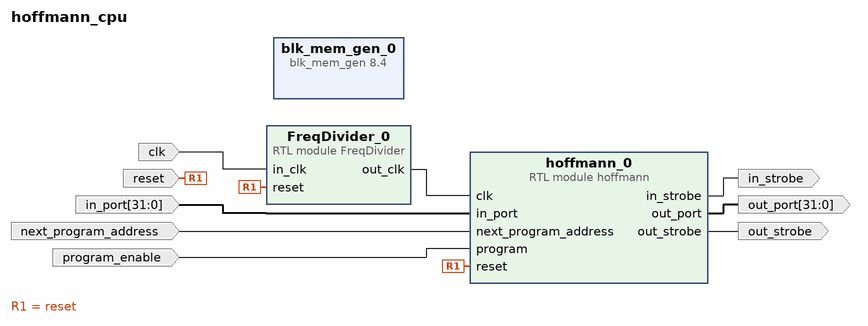
[diagram p0: block diagram of the top level]
# Vivado block design hoffmann_cpu, xc7s25csga225-2, Vivado 2022.2
create_bd_design hoffmann_cpu

create_bd_port -dir I -type rst reset
create_bd_port -dir I -type clk clk
set_property -dict {CONFIG.FREQ_HZ 100000000} [get_bd_ports clk]
create_bd_port -dir I program_enable
create_bd_port -dir I next_program_address
create_bd_port -dir I -from 31 -to 0 in_port
create_bd_port -dir O -from 31 -to 0 out_port
create_bd_port -dir O in_strobe
create_bd_port -dir O out_strobe

create_bd_cell -type module -reference FreqDivider FreqDivider_0
create_bd_cell -type module -reference hoffmann hoffmann_0
create_bd_cell -type ip -vlnv xilinx.com:ip:blk_mem_gen:8.4 blk_mem_gen_0
set_property -dict {CONFIG.Write_Depth_A 30000 CONFIG.use_bram_block Stand_Alone} [get_bd_cells blk_mem_gen_0]

# ---- connections ----

connect_bd_net [get_bd_pins FreqDivider_0/out_clk] [get_bd_pins hoffmann_0/clk]
connect_bd_net [get_bd_ports clk] [get_bd_pins FreqDivider_0/in_clk]
connect_bd_net [get_bd_pins hoffmann_0/in_strobe] [get_bd_ports in_strobe]
connect_bd_net [get_bd_pins hoffmann_0/out_port] [get_bd_ports out_port]
connect_bd_net [get_bd_pins hoffmann_0/out_strobe] [get_bd_ports out_strobe]
connect_bd_net [get_bd_ports in_port] [get_bd_pins hoffmann_0/in_port]
connect_bd_net [get_bd_ports next_program_address] [get_bd_pins hoffmann_0/next_program_address]
connect_bd_net [get_bd_ports program_enable] [get_bd_pins hoffmann_0/program]
connect_bd_net [get_bd_ports reset] [get_bd_pins FreqDivider_0/reset] [get_bd_pins hoffmann_0/reset]

validate_bd_design
save_bd_design
